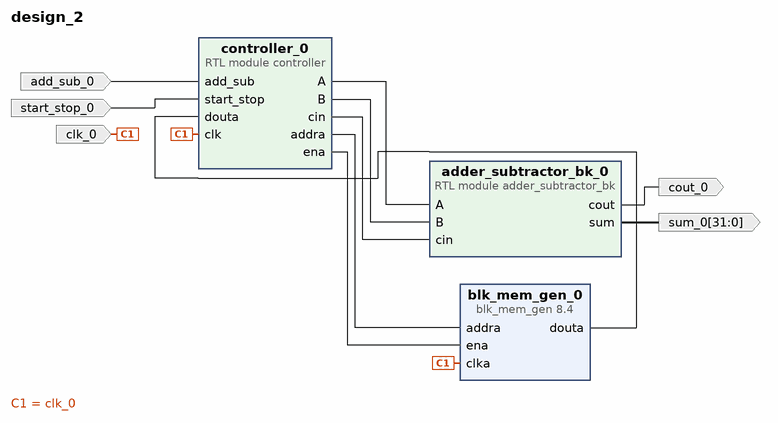
[diagram p0: block diagram of the top level]
# Vivado block design design_2, xc7z020clg400-1, Vivado 2020.2
create_bd_design design_2

create_bd_port -dir I add_sub_0
create_bd_port -dir I start_stop_0
create_bd_port -dir I -type clk clk_0
create_bd_port -dir O cout_0
create_bd_port -dir O -from 31 -to 0 sum_0

create_bd_cell -type ip -vlnv xilinx.com:ip:blk_mem_gen:8.4 blk_mem_gen_0
set_property -dict [list \
  CONFIG.Coe_File Bram.coe \
  CONFIG.Enable_32bit_Address false \
  CONFIG.Load_Init_File true \
  CONFIG.Read_Width_A 64 \
  CONFIG.Register_PortA_Output_of_Memory_Primitives true \
  CONFIG.Use_Byte_Write_Enable false \
  CONFIG.Use_RSTA_Pin false \
  CONFIG.Write_Depth_A 16 \
  CONFIG.Write_Width_A 64 \
  CONFIG.use_bram_block Stand_Alone \
] [get_bd_cells blk_mem_gen_0]
create_bd_cell -type module -reference adder_subtractor_bk adder_subtractor_bk_0
create_bd_cell -type module -reference controller controller_0

# ---- connections ----

connect_bd_net [get_bd_pins controller_0/addra] [get_bd_pins blk_mem_gen_0/addra]
connect_bd_net [get_bd_pins controller_0/ena] [get_bd_pins blk_mem_gen_0/ena]
connect_bd_net [get_bd_pins blk_mem_gen_0/douta] [get_bd_pins controller_0/douta]
connect_bd_net [get_bd_pins controller_0/A] [get_bd_pins adder_subtractor_bk_0/A]
connect_bd_net [get_bd_pins controller_0/B] [get_bd_pins adder_subtractor_bk_0/B]
connect_bd_net [get_bd_pins controller_0/cin] [get_bd_pins adder_subtractor_bk_0/cin]
connect_bd_net -net add_sub_0_1 [get_bd_ports add_sub_0] [get_bd_pins controller_0/add_sub]
connect_bd_net -net start_stop_0_1 [get_bd_ports start_stop_0] [get_bd_pins controller_0/start_stop]
connect_bd_net -net clk_0_1 [get_bd_ports clk_0] [get_bd_pins blk_mem_gen_0/clka] [get_bd_pins controller_0/clk]
connect_bd_net [get_bd_pins adder_subtractor_bk_0/cout] [get_bd_ports cout_0]
connect_bd_net [get_bd_pins adder_subtractor_bk_0/sum] [get_bd_ports sum_0]

validate_bd_design
save_bd_design
